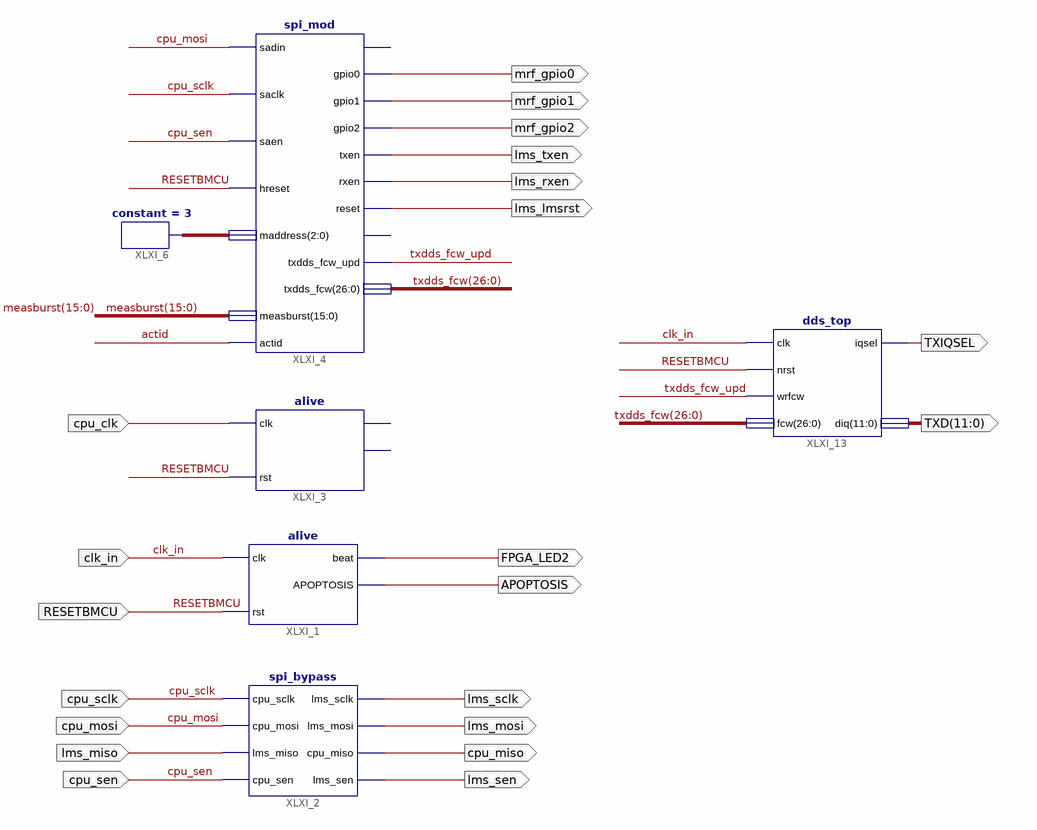
[diagram p0: schematic sheet 1]
// Xilinx ISE schematic top.sch (spartan6) as structural Verilog: 6 symbols, 21 ports
module top (
  input  RESETBMCU,
  input  cpu_mosi,
  input  cpu_sclk,
  input  cpu_sen,
  input  lms_miso,
  input  clk_in,
  input  cpu_clk,
  output APOPTOSIS,
  output lms_sclk,
  output lms_mosi,
  output lms_sen,
  output lms_txen,
  output lms_rxen,
  output lms_lmsrst,
  output mrf_gpio0,
  output mrf_gpio1,
  output mrf_gpio2,
  output FPGA_LED2,
  output cpu_miso,
  output TXIQSEL,
  output [11:0] TXD
);

  wire actid, txdds_fcw_upd;
  wire [2:0] XLXN_30;
  wire [15:0] measburst;
  wire [26:0] txdds_fcw;

  spi_mod XLXI_4 (
    .sadin(cpu_mosi), .saclk(cpu_sclk), .saen(cpu_sen), .hreset(RESETBMCU), .maddress(XLXN_30),
    .measburst(measburst), .gpio0(mrf_gpio0), .gpio1(mrf_gpio1), .gpio2(mrf_gpio2), .txen(lms_txen),
    .rxen(lms_rxen), .reset(lms_lmsrst), .txdds_fcw_upd(txdds_fcw_upd), .txdds_fcw(txdds_fcw), .actid(actid));  // open: sadout, oen
  alive XLXI_1 (.clk(clk_in), .beat(FPGA_LED2), .APOPTOSIS(APOPTOSIS), .rst(RESETBMCU));
  spi_bypass XLXI_2 (
    .cpu_sclk(cpu_sclk), .cpu_mosi(cpu_mosi), .lms_miso(lms_miso), .cpu_sen(cpu_sen), .lms_sclk(lms_sclk),
    .lms_mosi(lms_mosi), .cpu_miso(cpu_miso), .lms_sen(lms_sen));
  alive XLXI_3 (.clk(cpu_clk), .rst(RESETBMCU));  // open: beat, APOPTOSIS
  dds_top XLXI_13 (.clk(clk_in), .nrst(RESETBMCU), .wrfcw(txdds_fcw_upd), .fcw(txdds_fcw), .iqsel(TXIQSEL), .diq(TXD));
  constant #(.CValue("3")) XLXI_6 (.O(XLXN_30));
endmodule
